# Altium project e.PrjPcb (part 2 of 2)
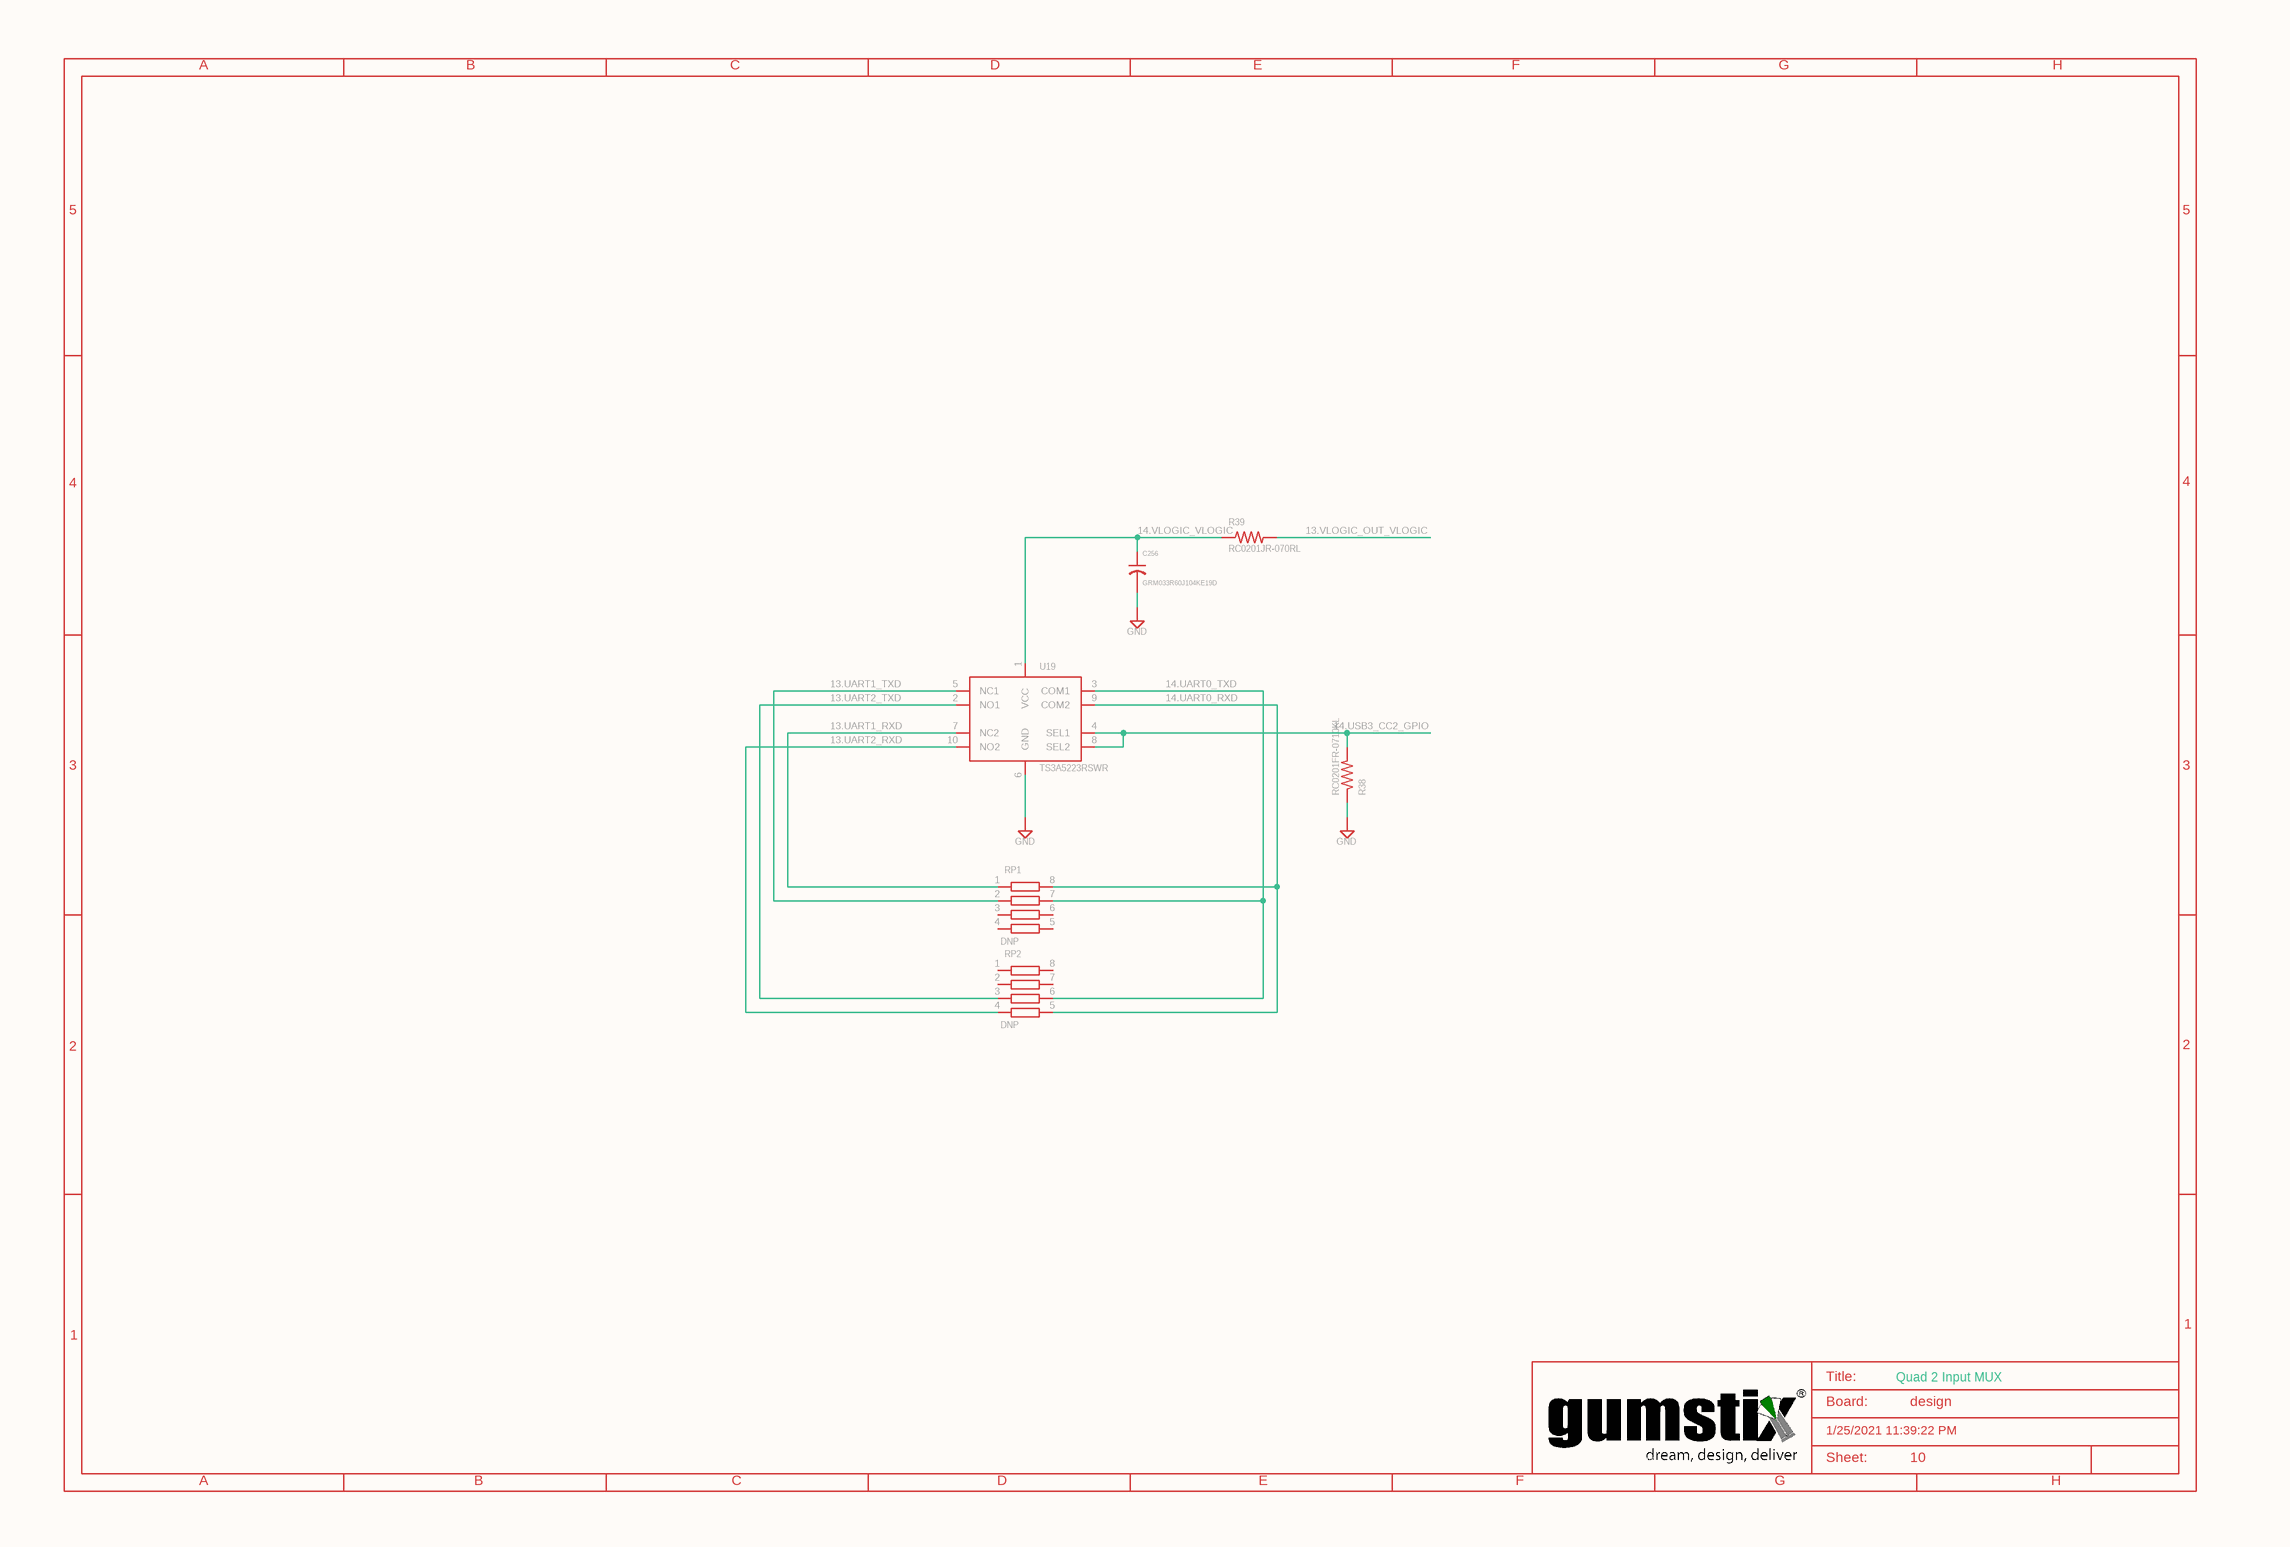
[diagram p14: design_9.SchDoc]

## Nets that join several sheets
1.USB_DEVICE_D_N: design_1 (IC6.15), design_7 (L7.2)
1.USB_DEVICE_D_P: design_1 (IC6.14), design_7 (L7.3)
1.USB_DEVICE_VBUS: design_1 (FB10.1), design_7 (R31.1)
2.5.0V_VCC_5.0: design_10 (6 pins), design_12 (U12.2 U12.4), design_3 (7 pins)
3.3.3V_VCC_3.3: design_12 (U12.17), design_13 (19 pins), design_3 (6 pins), design_4 (C63.1 C64.1 FB9.2), design_6 (R29.2)
13.UART1_RXD: design_12 (U12.10), design_9 (RP1.1 U19.7)
13.UART1_TXD: design_12 (U12.8), design_9 (RP1.2 U19.5)
13.UART2_RXD: design_1 (IC3.4), design_9 (RP2.4 U19.10)
13.UART2_TXD: design_1 (IC6.2), design_9 (RP2.3 U19.2)
13.VLOGIC_OUT_VLOGIC: design_1 (5 pins), design_9 (R39.2)
14.3.3V_VCC_3.3: design_10 (Q3.3 R49.2), design_12 (U12.1), design_16 (15 pins)
14.1000BaseT_LINK_1000: design_10 (J5.17), design_4 (J4.13)
14.1000BaseT_LINK_ACT: design_10 (J5.15), design_4 (J4.11)
14.1000BaseT_TR0_N: design_10 (J5.10), design_4 (J4.2 R33.1 U8.2 9)
14.1000BaseT_TR0_P: design_10 (J5.12), design_4 (J4.1 R42.1 U8.1 10)
14.1000BaseT_TR1_N: design_10 (J5.6), design_4 (J4.4 R35.1 U8.5 6)
14.1000BaseT_TR1_P: design_10 (J5.4), design_4 (J4.3 R34.1 U8.4 7)
14.1000BaseT_TR2_N: design_10 (J5.9), design_4 (J4.8 R36.1 U16.2 9)
14.1000BaseT_TR2_P: design_10 (J5.11), design_4 (J4.7 R23.1 U16.1 10)
14.1000BaseT_TR3_N: design_10 (J5.5), design_4 (J4.10 R58.1 U16.5 6)
14.1000BaseT_TR3_P: design_10 (J5.3), design_4 (J4.9 R37.1 U16.4 7)
14.GPIO2_GPIO: design_10 (J5.58), design_12 (U12.3)
14.GPIO3_GPIO: design_10 (J5.56), design_12 (U12.5)
14.GPIO4_GPIO: design_10 (J5.54), design_12 (U12.7)
14.GPIO5_GPIO: design_10 (J5.34), design_12 (U12.29)
14.GPIO6_GPIO: design_10 (J5.30), design_12 (U12.31)
14.GPIO7_GPIO: design_10 (J5.37), design_12 (U12.26)
14.GPIO8_GPIO: design_10 (J5.39), design_12 (U12.24)
14.GPIO9_GPIO: design_10 (J5.40), design_12 (U12.21)
14.GPIO10_GPIO: design_10 (J5.44), design_12 (U12.19)
14.GPIO11_GPIO: design_10 (J5.38), design_12 (U12.23)
14.GPIO12_GPIO: design_10 (J5.31), design_12 (U12.32)
14.GPIO13_GPIO: design_10 (J5.28), design_12 (U12.33)
14.GPIO16_GPIO: design_10 (J5.29), design_12 (U12.36)
14.GPIO17_GPIO: design_10 (J5.50), design_12 (U12.11)
14.GPIO18_GPIO: design_10 (J5.49), design_12 (U12.12)
14.GPIO19_GPIO: design_10 (J5.26), design_12 (U12.35)
14.GPIO20_GPIO: design_10 (J5.27), design_12 (U12.38)
14.GPIO21_GPIO: design_10 (J5.25), design_12 (U12.40)
14.GPIO22_GPIO: design_10 (J5.46), design_12 (U12.15)
14.GPIO23_GPIO: design_10 (J5.47), design_12 (U12.16)
14.GPIO24_GPIO: design_10 (J5.45), design_12 (U12.18)
14.GPIO25_GPIO: design_10 (J5.41), design_12 (U12.22)
14.GPIO26_GPIO: design_10 (J5.24), design_12 (U12.37)
14.GPIO27_GPIO: design_10 (J5.48), design_12 (U12.13)
14.I2C_ID_SCL: design_10 (J5.35), design_12 (U12.28)
14.I2C_ID_SDA: design_10 (J5.36), design_12 (U12.27)
14.nRESET_NRESET: design_10 (J5.92), design_22 (C319.1 R71.2)
14.PCIE_CLK_N: design_10 (J2.12), design_13 (U10.49)
14.PCIE_CLK_P: design_10 (J2.10), design_13 (U10.48)
14.PCIE_CLKREQ_GPIO: design_10 (J2.2), design_13 (R27.1 U10.9)
14.PCIE_RST_GPIO: design_10 (J2.9), design_13 (R55.1 U10.30)
14.PCIE_RX0_N: design_10 (J2.18), design_13 (C273.1)
14.PCIE_RX0_P: design_10 (J2.16), design_13 (C263.1)
14.PCIE_TX0_N: design_10 (J2.24), design_13 (C253.1)
14.PCIE_TX0_P: design_10 (J2.22), design_13 (C254.1)
14.SYS_EN_SYSEN: design_10 (J5.100 Q1.1 R51.2), design_6 (R30.2 R40.1)
14.UART0_RXD: design_10 (J5.51), design_9 (RP1.8 RP2.5 U19.9)
14.UART0_TXD: design_10 (J5.55), design_9 (RP1.7 RP2.6 U19.3)
14.USB3_CC2_GPIO: design_10 (J5.96), design_9 (R38.2 U19.4 U19.8)
14.VLOGIC_VLOGIC: design_10 (R49.1), design_22 (R70.2), design_9 (C256.1 R39.1 U19.1)
16.USBH1_D_N: design_13 (U10.22), design_16 (U15.46)
16.USBH1_D_P: design_13 (U10.23), design_16 (U15.45)
16.USBH1_SSRX_N: design_13 (U10.46), design_16 (C295.1)
16.USBH1_SSRX_P: design_13 (U10.45), design_16 (C296.1)
16.USBH1_SSTX_N: design_13 (U10.43), design_16 (C303.1)
16.USBH1_SSTX_P: design_13 (U10.42), design_16 (C294.1)
19.USBH1_D_N: design_16 (U15.2), design_17 (L18.2)
19.USBH1_D_P: design_16 (U15.1), design_17 (L18.3)
19.USBH1_DRV_VBUS: design_16 (R65.2), design_17 (U24.3)
19.USBH1_NOC: design_16 (R65.1 U15.36), design_17 (U24.8)
19.USBH1_SSRX_N: design_16 (U15.7), design_17 (L16.3)
19.USBH1_SSRX_P: design_16 (U15.6), design_17 (L16.2)
19.USBH1_SSTX_N: design_16 (U15.4), design_17 (C9.1)
19.USBH1_SSTX_P: design_16 (U15.3), design_17 (C8.1)
19.USBH2_D_N: design_16 (U15.9), design_17 (L4.2)
19.USBH2_D_P: design_16 (U15.8), design_17 (L4.3)
19.USBH2_DRV_VBUS: design_16 (R69.2), design_17 (U24.4)
19.USBH2_NOC: design_16 (R69.1 U15.35), design_17 (U24.5)
19.USBH2_SSRX_N: design_16 (U15.14), design_17 (L5.3)
19.USBH2_SSRX_P: design_16 (U15.13), design_17 (L5.2)
19.USBH2_SSTX_N: design_16 (U15.11), design_17 (C11.1)
19.USBH2_SSTX_P: design_16 (U15.10), design_17 (C10.1)
COMMON_SHIELD: design_17 (10 pins), design_4 (J4.15 J4.16 U8.3 8 U16.3 8), design_7 (10 pins)
GND: design_12 (8 pins), design_6 (Q5.2 R30.1 SUPPLY96.?1)